# Altium schematic sheet Sheet1.SchDoc
size 420 x 594 mm; Scale: {Масш.}; Title1str: {Наименование}; PageSetup: Record=PageOptions|CenterHorizontal=False|CenterVertical=False|PrintScale=0.33|XCorrection=0.00|YCorrection=0.00|PrintKind=1|BorderSize=5000000|LeftOffset=0|BottomOffset=0|Orientation=1|PaperLength=1000|PaperWidth=1000|Scale=100|PaperSource=15|PrintQuality=600|MediaType=1|DitherType=10|PaperKind=A4|PrintScaleMode=1; Title2str: {Наименование}; ProcessInspection: {Т.контр.}; Mass: {Масса}; NormInspection: {Н.контр.}; EngineerName: {Инженер}; Letter1Column: {}; Letter2Column: {}; Letter3Column: {}; DocumentType: {Документ}; DocumentType1str: {Документ}; DocumentType2str: {Документ}; NachKonstrSekt: {Нач. КС}; NachPodrVydTz: {Нач.подр.выд.ТЗ}; NachSektNadezn: {Нач. СН}; ZamPoKonstr: {ZamPoKonstr}
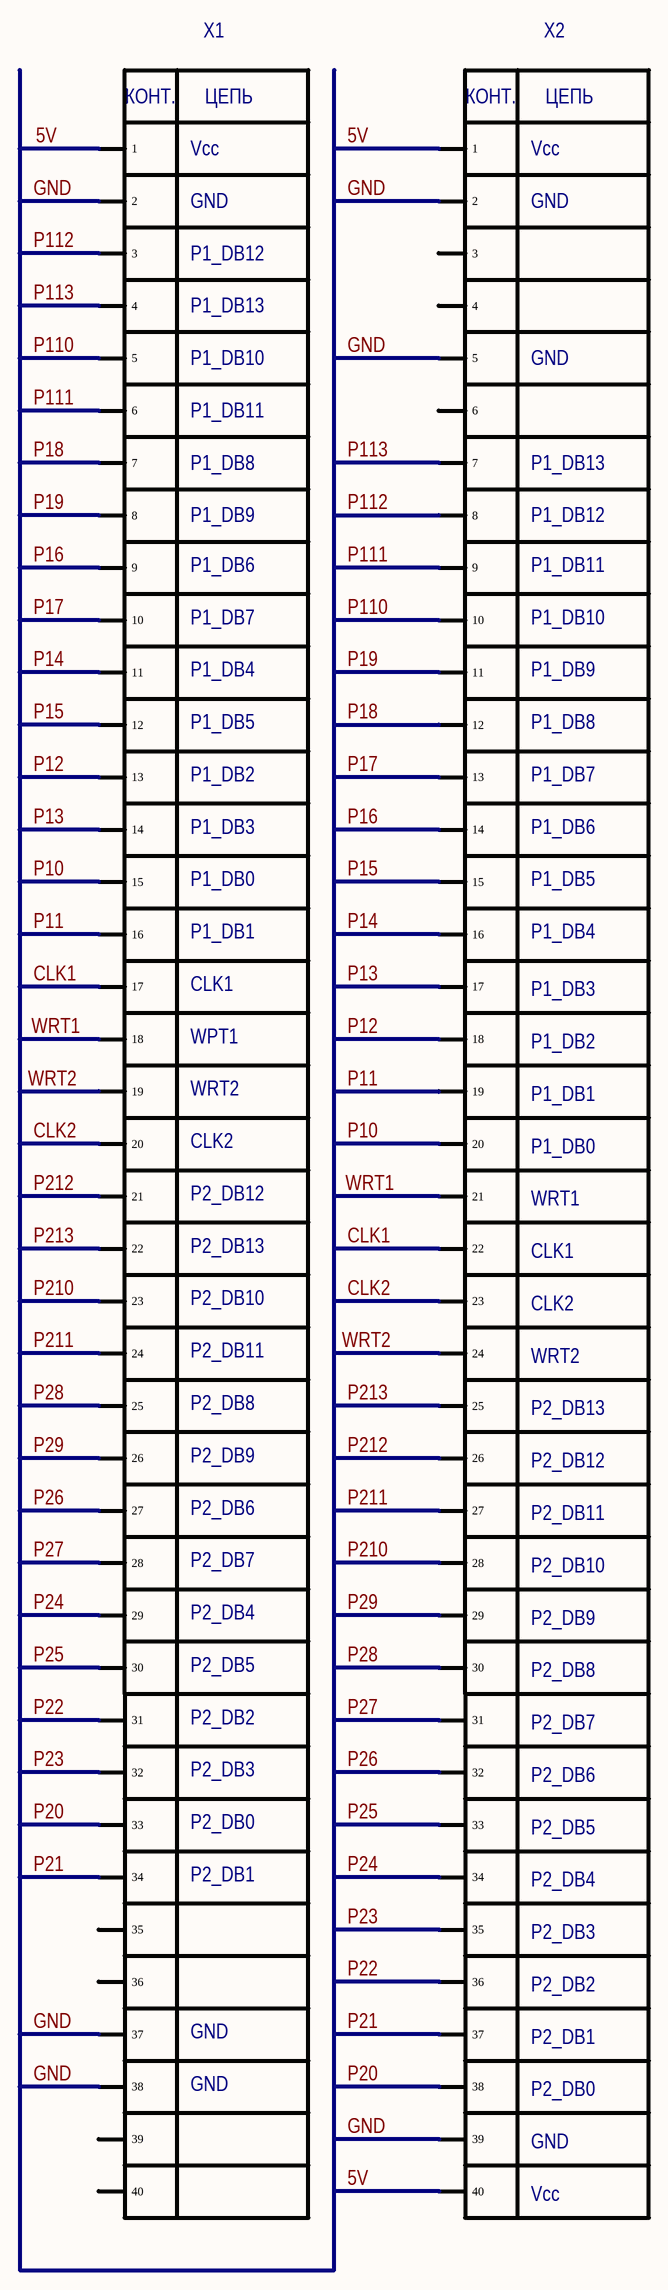
[diagram p0: Sheet1.SchDoc]

## Parts
X1  PLD40  [PLD-40]  (value not drawn)
X2  PLD40  [PLD-40]  (value not drawn)

## Nets
5V: X1.1 X2.1 X2.40
CLK1: X1.17 X2.22
CLK2: X1.20 X2.23
GND: X1.2 X1.37 X1.38 X2.2 X2.5 X2.39
P10: X1.15 X2.20
P11: X1.16 X2.19
P12: X1.13 X2.18
P13: X1.14 X2.17
P14: X1.11 X2.16
P15: X1.12 X2.15
P16: X1.9 X2.14
P17: X1.10 X2.13
P18: X1.7 X2.12
P19: X1.8 X2.11
P20: X1.33 X2.38
P21: X1.34 X2.37
P22: X1.31 X2.36
P23: X1.32 X2.35
P24: X1.29 X2.34
P25: X1.30 X2.33
P26: X1.27 X2.32
P27: X1.28 X2.31
P28: X1.25 X2.30
P29: X1.26 X2.29
P110: X1.5 X2.10
P111: X1.6 X2.9
P112: X1.3 X2.8
P113: X1.4 X2.7
P210: X1.23 X2.28
P211: X1.24 X2.27
P212: X1.21 X2.26
P213: X1.22 X2.25
WRT1: X1.18 X2.21
WRT2: X1.19 X2.24

Not connected (* = marked no-connect by the designer): X1 35 36 39 40; X2 3 4 6

## Notes on the sheet
- Vcc
- GND
- P1_DB12
- P1_DB13
- P1_DB10
- P1_DB11
- P1_DB8
- P1_DB9
- P1_DB6
- P1_DB7
- P1_DB4
- P1_DB5
- P1_DB2
- P1_DB3
- P1_DB0
- CLK1
- P1_DB1
- WPT1
- WRT2
- CLK2
- P2_DB12
- P2_DB13
- WRT1
- P2_DB10
- P2_DB11
- P2_DB9
- P2_DB8
- P2_DB6
- P2_DB7
- P2_DB4
- P2_DB2
- P2_DB5
- P2_DB3
- P2_DB0
- P2_DB1
- Перв. примен.
- Справ. №
- Подп. и дата
- Инв. № дубл.
- Взам. инв. №
- Изм.
- Лист
- № докум.
- Подп.
- Дата
- Лит.
- Масса
- Масштаб
- Т.контр.
- Пров.
- Разраб.
- Листов
- Инв. № подл.
- Н.контр.
- Утв.
- Копировал
- Формат А2
- (in symbol PLD40) КОНТ.; ЦЕПЬ

## Library data of the parts
X1 X2 = PLD40: Штыри на плату, шаг 2.54мм., двухрядные; BCPId: *; ManufacturerPartNumber: PLD40; Rem: *; Package: *; TU/GOST: *; Type: Вилка; HelpURL: *; Price: *